# EAGLE design kapcsrajz (EAGLE 6.4)

## Sheet 1 of 5
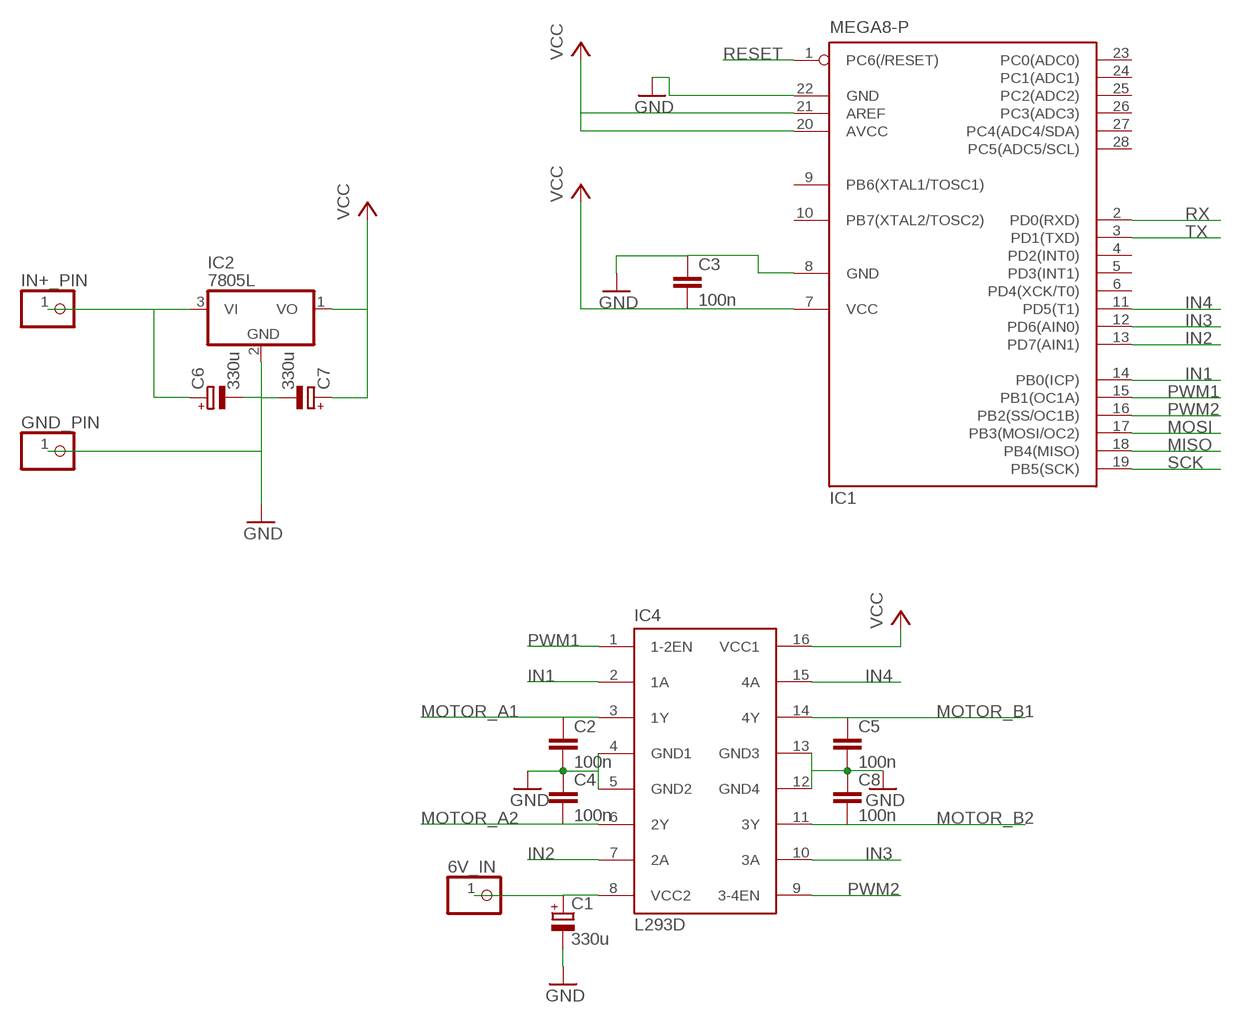
[diagram p0: schematic, sheet 1]

### Parts
6V_IN  PINHD-1X1  [1X01]
C1  330u  CPOL-EUE2,5-6E  [E2,5-6E]
C2  100n  C-EU025-030X050  [C025-030X050]
C3  100n  C-EU025-030X050  [C025-030X050]
C4  100n  C-EU025-030X050  [C025-030X050]
C5  100n  C-EU025-030X050  [C025-030X050]
C6  330u  CPOL-EUE2,5-6E  [E2,5-6E]
C7  330u  CPOL-EUE2,5-6E  [E2,5-6E]
C8  100n  C-EU025-030X050  [C025-030X050]
GND_PIN  PINHD-1X1  [1X01]
IC1  MEGA8-P  [DIL28-3]
IC2  7805L  [TO92]
IC4  L293D  [DIL16]
IN+_PIN  PINHD-1X1  [1X01]

### Nets
GND: C1.- C2.2 C3.1 C4.1 C5.2 C6.- C7.- C8.1 GND_PIN.1 IC1.8(GND) IC1.22(GND) IC2.2(GND) IC4.4(GND1) IC4.5(GND2) IC4.12(GND4) IC4.13(GND3) ; also sheet 2,3,4,5
IN1: IC1.14(PB0(ICP)) IC4.2(1A)
IN2: IC1.13(PD7(AIN1)) IC4.7(2A)
IN3: IC1.12(PD6(AIN0)) IC4.10(3A)
IN4: IC1.11(PD5(T1)) IC4.15(4A)
MISO: IC1.18(PB4(MISO)) ; also sheet 4
MOSI: IC1.17(PB3(MOSI/OC2)) ; also sheet 4,5
MOTOR_A1: C2.1 IC4.3(1Y) ; also sheet 5
MOTOR_A2: C4.2 IC4.6(2Y) ; also sheet 5
MOTOR_B1: C5.1 IC4.14(4Y) ; also sheet 5
MOTOR_B2: C8.2 IC4.11(3Y) ; also sheet 5
N$2: C6.+ IC2.3(VI) IN+_PIN.1
N$7: 6V_IN.1 C1.+ IC4.8(VCC2)
PWM1: IC1.15(PB1(OC1A)) IC4.1(1-2EN)
PWM2: IC1.16(PB2(SS/OC1B)) IC4.9(3-4EN)
RESET: IC1.1(PC6(/RESET)) ; also sheet 4
RX: IC1.2(PD0(RXD)) ; also sheet 3
SCK: IC1.19(PB5(SCK)) ; also sheet 4
TX: IC1.3(PD1(TXD)) ; also sheet 3
VCC: C3.2 C7.+ IC1.7(VCC) IC1.20(AVCC) IC1.21(AREF) IC2.1(VO) IC4.16(VCC1) ; also sheet 4,5
Unconnected: IC1.4(PD2(INT0)) IC1.5(PD3(INT1)) IC1.6(PD4(XCK/T0)) IC1.9(PB6(XTAL1/TOSC1)) IC1.10(PB7(XTAL2/TOSC2)) IC1.23(PC0(ADC0)) IC1.24(PC1(ADC1)) IC1.25(PC2(ADC2)) IC1.26(PC3(ADC3)) IC1.27(PC4(ADC4/SDA)) IC1.28(PC5(ADC5/SCL))

## Sheet 2 of 5
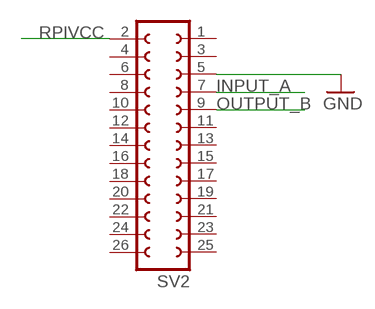
[diagram p1: schematic, sheet 2]

### Parts
SV2  FE13-2  [FE13-2]

### Nets
GND: SV2.5 ; also sheet 1,3,4,5
INPUT_A: SV2.7 ; also sheet 3
OUTPUT_B: SV2.9 ; also sheet 3
RPIVCC: SV2.2 ; also sheet 3
Unconnected: SV2.1 SV2.3 SV2.4 SV2.6 SV2.8 SV2.10 SV2.11 SV2.12 SV2.13 SV2.14 SV2.15 SV2.16 SV2.17 SV2.18 SV2.19 SV2.20 SV2.21 SV2.22 SV2.23 SV2.24 SV2.25 SV2.26

## Sheet 3 of 5
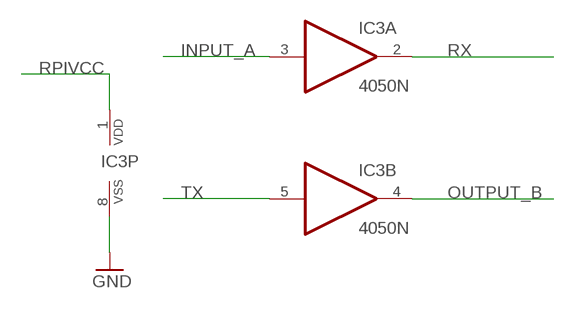
[diagram p2: schematic, sheet 3]

### Parts
IC3  4050N  [DIL16]

### Nets
GND: IC3.8(P:VSS) ; also sheet 1,2,4,5
INPUT_A: IC3.3(A:I) ; also sheet 2
OUTPUT_B: IC3.4(B:O) ; also sheet 2
RPIVCC: IC3.1(P:VDD) ; also sheet 2
RX: IC3.2(A:O) ; also sheet 1
TX: IC3.5(B:I) ; also sheet 1
Unconnected: IC3.6(C:O) IC3.7(C:I) IC3.9(D:I) IC3.10(D:O) IC3.11(E:I) IC3.12(E:O) IC3.14(F:I) IC3.15(F:O)

## Sheet 4 of 5
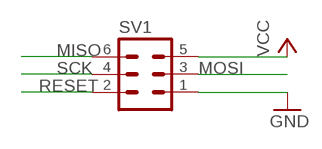
[diagram p3: schematic, sheet 4]

### Parts
SV1  MA03-2  [MA03-2]

### Nets
GND: SV1.1 ; also sheet 1,2,3,5
MISO: SV1.6 ; also sheet 1
MOSI: SV1.3 ; also sheet 1,5
RESET: SV1.2 ; also sheet 1
SCK: SV1.4 ; also sheet 1
VCC: SV1.5 ; also sheet 1,5

## Sheet 5 of 5
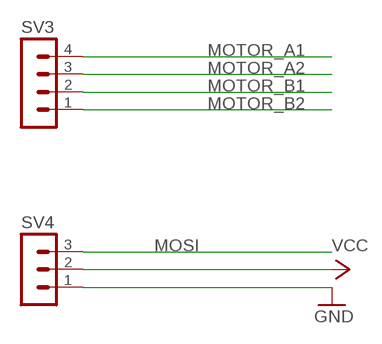
[diagram p4: schematic, sheet 5]

### Parts
SV3  MA04-1  [MA04-1]
SV4  MA03-1  [MA03-1]

### Nets
GND: SV4.1 ; also sheet 1,2,3,4
MOSI: SV4.3 ; also sheet 1,4
MOTOR_A1: SV3.4 ; also sheet 1
MOTOR_A2: SV3.3 ; also sheet 1
MOTOR_B1: SV3.2 ; also sheet 1
MOTOR_B2: SV3.1 ; also sheet 1
VCC: SV4.2 ; also sheet 1,4

## Library data of the parts
6V_IN GND_PIN IN+_PIN = pinhead:PINHD-1X1: PIN HEADER
C1 C6 C7 = rcl:CPOL-EU: POLARIZED CAPACITOR, European symbol
C2-C5 C8 = rcl:C-EU: CAPACITOR, European symbol
IC1 = atmel:MEGA8-P: MICROCONTROLLER 8 Kbytes FLASH, 1 kbytes SRAM, 512 bytes EEPROM, USART, 4-channel 10 bit ADC, 2-channel 8 bit ADC Pin compatible with Atmega48, ATMega88, ATMega168 Source: avr.lbr; OC_FARNELL: unknown; OC_NEWARK: unknown
IC2 = linear:78*: Positive VOLTAGE REGULATOR Source: http://cache.national.com/ds/LM/LM78L05.pdf http://www.fairchildsemi.com/ds/LM/LM7805.pdf
IC3 = 40xx:4050: Hex non-inverting BUFFER
IC4 = st-microelectronics:L293D: PUSH-PULL 4 CHANNEL DRIVER; MPN: L293D; OC_FARNELL: 9589619; OC_NEWARK: 56P8249
SV1 = con-lstb:MA03-2: PIN HEADER; OC_FARNELL: unknown; OC_NEWARK: unknown
SV2 = con-lsta:FE13-2: FEMALE HEADER; OC_FARNELL: unknown; OC_NEWARK: unknown
SV3 = con-lstb:MA04-1: PIN HEADER; OC_FARNELL: unknown; OC_NEWARK: unknown
SV4 = con-lstb:MA03-1: PIN HEADER; OC_FARNELL: unknown; OC_NEWARK: unknown

## Board
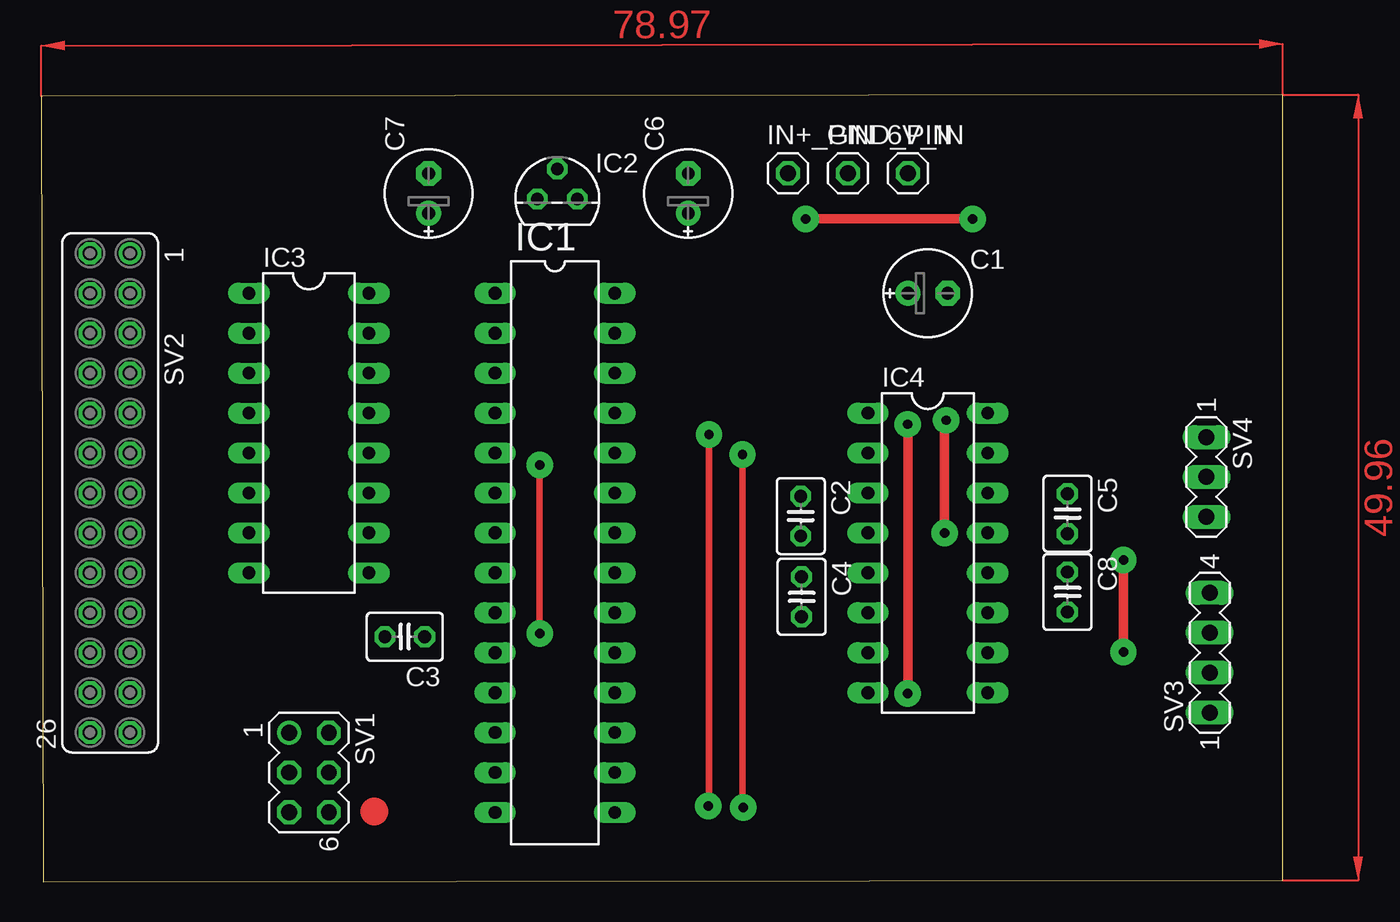
[diagram p5: board, top side]
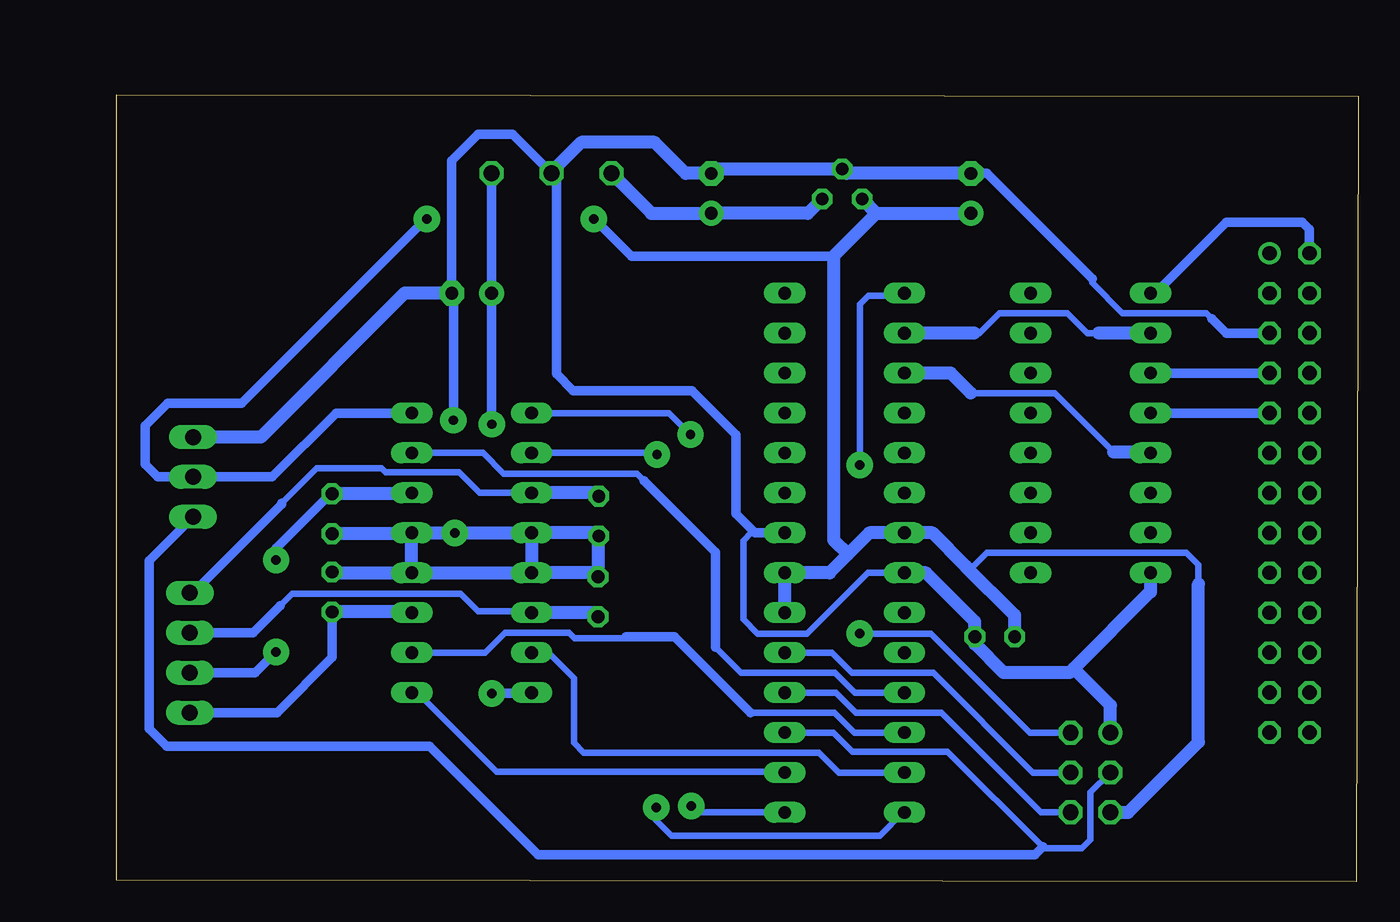
[diagram p6: board, bottom side, seen from below]

Size 78.97 x 50.06 mm. Coordinates in mm from the lower left corner, seen from the top.
Outline: 0.1,0 78.97,0.1 78.97,50.06 0,49.96 0.1,0
Copper layers (1*16): Top 0.035mm / dielectric 1.5mm / Bottom 0.035mm
Design rules "default *": minimum track width 10mil, minimum drill 24mil, track to track 10mil, track to pad 10mil, pad to pad 10mil, via to via 10mil, smd to smd 10mil, copper to edge 40mil, drill to drill 8mil, minimum pad ring 10mil, minimum via ring 8mil, stop-mask expansion 4mil, vias tented up to drill 0mil, thermal gap 10mil

### Footprints (pad centres in the part's own frame; a part is rotated, then mirrored left to right if it is on the bottom)
1X01 = drill 1.016 octagon: 1 0,0
E2,5-6E = drill 0.813 pad 1.575: + -1.27,0 | drill 0.813 pad 1.575 octagon: - 1.27,0
C025-030X050 = drill 0.813 octagon: 1 -1.27,0; 2 1.27,0
DIL28-3 = drill 0.813 long: 1 -16.51,-3.81; 2 -13.97,-3.81; 3 -11.43,-3.81; 4 -8.89,-3.81; 5 -6.35,-3.81; 6 -3.81,-3.81; 7 -1.27,-3.81; 8 1.27,-3.81; 9 3.81,-3.81; 10 6.35,-3.81; 11 8.89,-3.81; 12 11.43,-3.81; 13 13.97,-3.81; 14 16.51,-3.81; 15 16.51,3.81; 16 13.97,3.81; 17 11.43,3.81; 18 8.89,3.81; 19 6.35,3.81; 20 3.81,3.81; 21 1.27,3.81; 22 -1.27,3.81; 23 -3.81,3.81; 24 -6.35,3.81; 25 -8.89,3.81; 26 -11.43,3.81; 27 -13.97,3.81; 28 -16.51,3.81
TO92 = drill 0.813 octagon: 1 -1.27,0; 2 0,1.905; 3 1.27,0
DIL16 = drill 0.813 long: 1 -8.89,-3.81; 2 -6.35,-3.81; 3 -3.81,-3.81; 4 -1.27,-3.81; 5 1.27,-3.81; 6 3.81,-3.81; 7 6.35,-3.81; 8 8.89,-3.81; 9 8.89,3.81; 10 6.35,3.81; 11 3.81,3.81; 12 1.27,3.81; 13 -1.27,3.81; 14 -3.81,3.81; 15 -6.35,3.81; 16 -8.89,3.81
MA03-2 = drill 1.016: 1 -2.54,-1.27 | drill 1.016 octagon: 2 -2.54,1.27; 3 0,-1.27; 4 0,1.27; 5 2.54,-1.27; 6 2.54,1.27
FE13-2 = drill 0.914: 1 -15.24,1.27 | drill 0.914 octagon: 2 -15.24,-1.27; 3 -12.7,1.27; 4 -12.7,-1.27; 5 -10.16,1.27; 6 -10.16,-1.27; 7 -7.62,1.27; 8 -7.62,-1.27; 9 -5.08,1.27; 10 -5.08,-1.27; 11 -2.54,1.27; 12 -2.54,-1.27; 13 0,1.27; 14 0,-1.27; 15 2.54,1.27; 16 2.54,-1.27; 17 5.08,1.27; 18 5.08,-1.27; 19 7.62,1.27; 20 7.62,-1.27; 21 10.16,1.27; 22 10.16,-1.27; 23 12.7,1.27; 24 12.7,-1.27; 25 15.24,1.27; 26 15.24,-1.27
MA04-1 = drill 1.016 long: 1 -3.81,0; 2 -1.27,0; 3 1.27,0; 4 3.81,0
MA03-1 = drill 1.016 long: 1 -2.54,0; 2 0,0; 3 2.54,0

### Placement (x,y rotation side)
6V_IN  55.12,45.06 0 top
C1  56.39,37.44 0 top
C2  48.31,23.27 270 top
C3  23.11,15.6 180 top
C4  48.36,18.14 270 top
C5  65.28,23.42 270 top
C6  41.15,43.79 90 top
C7  24.64,43.79 90 top
C8  65.28,18.44 270 top
GND_PIN  51.31,45.06 0 top
IC1  32.66,20.93 270 top
IC2  32.82,43.43 0 top
IC3  17.02,28.55 270 top
IC4  56.39,20.93 270 top
IN+_PIN  47.5,45.06 0 top
SV1  17.02,6.96 270 top
SV2  4.37,24.74 270 top
SV3  74.32,14.58 90 top
SV4  74.12,25.76 270 top

### Tracks (layer width: path | path; a pad name or v marks a point on that pad's centre or on a via)
GND  (via drill 0.6 pad 1.68)
  Top 0.61: v57.56,29.36 57.45,29.26 v57.45,22.2
  Bottom 0.406: 9.3,35.81 9.65,36.17 14.99,36.17 16.92,38.1 16.92,38.35 | IC1.8 31.19,19.66 35.05,15.8 38.2,15.8 39.12,16.71 39.12,21.69 38.61,22.2 IC1.22
  Bottom 0.61: v57.56,29.36 57.56,37.34 C1.- 57.66,45.87 55.98,47.55 53.8,47.55 GND_PIN.1 51,44.75 51,32.31 49.94,31.24 42.37,31.24 39.57,28.45 39.57,23.42 38.35,22.2 IC1.22 | SV2.5 8.38,34.9 9.3,35.81 | 16.92,38.35 23.62,45.06 C7.-
  Bottom 0.813: C7.- 32.54,45.06 IC2.2 40.87,45.34 C6.- 42.77,45.06 44.76,47.04 49.43,47.04 51.31,45.16 GND_PIN.1 | IC3.8 13.21,18.44 18.09,13.56 | 18.09,13.56 18.34,13.31 22.55,13.31 24.38,15.14 C3.1 24.38,16.56 27.48,19.66 IC1.8 | IC4.4 IC4.5 | C4.1 48.62,19.66 IC4.5 | IC4.4 48.51,22.2 C2.2 48.36,21.95 48.36,19.46 | IC4.13 v57.45,22.2 IC4.4 | IC4.5 IC4.12 65.23,19.66 C8.1 | IC4.13 60.25,22.15 60.25,19.61 | IC4.13 60.35,22.05 60.45,22.05 60.55,22.15 C5.2 | SV1.1 15.75,11.23 18.09,13.56 | C1.- 60.66,37.44 69.8,28.3 SV4.1
IN1  (via drill 0.6 pad 1.68)
  Top 0.406: v44.6,27.18 44.6,4.78 v44.65,4.72
  Bottom 0.406: 28.45,4.37 28.8,4.37 IC1.14 28.96,4.42 30.43,2.95 43.69,2.95 44.65,3.91 v44.65,4.72 | IC4.2 44.7,27.28 v44.6,27.18
IN2
  Bottom 0.406: IC1.13 33.02,6.96 34.29,8.23 49.28,8.23 49.89,8.84 49.89,12.95 51.71,14.78 51.92,14.58 IC4.7
IN3
  Bottom 0.406: IC1.12 32.05,9.5 33.33,10.77 38.66,10.77 | 46.58,15.6 46.69,15.49 49.84,15.49 50.19,15.85 54.25,15.85 55.52,14.58 IC4.10
  Bottom 0.61: 38.66,10.77 43.48,15.6 46.58,15.6
IN4
  Bottom 0.406: IC1.11 32,12.04 33.27,13.31 39.27,13.31 40.89,14.94 | 45.41,25.5 45.87,25.96 54.36,25.96 55.68,27.28 IC4.15
  Bottom 0.61: 40.89,14.94 40.89,20.98 45.41,25.5
INPUT_A
  Bottom 0.61: SV2.7 IC3.3
MISO
  Bottom 0.406: SV1.6 20.17,4.42 26.52,10.77 31.95,10.77 33.22,12.04 IC1.18
MOSI
  Bottom 0.406: SV1.3 17.02,5.69 17.02,2.69 17.58,2.13 19.96,2.13 20.07,2.24 26.11,8.28 32.16,8.28 33.38,9.5 IC1.17
  Bottom 0.61: SV4.3 76.91,20.42 76.91,9.75 75.79,8.64 59.08,8.64 52.17,1.73 20.57,1.73 20.07,2.24
MOTOR_A1
  Bottom 0.406: IC4.3 55.88,24.74 57.2,26.06 61.87,26.06 62.13,26.31 66.24,26.31 68.48,24.08
  Bottom 0.61: 68.48,24.08 68.48,24.03 74.12,18.39 SV3.4
  Bottom 0.813: C2.1 48.51,24.74 IC4.3
MOTOR_A2
  Bottom 0.406: IC4.6 52.48,17.22 | 52.48,17.22 52.43,17.22 | 52.48,17.22 55.98,17.22 57.1,18.34 67.82,18.34 68.58,17.58
  Bottom 0.61: 68.58,17.58 70.31,15.85 SV3.3
  Bottom 0.813: C4.2 48.62,17.12 IC4.6
MOTOR_B1  (via drill 0.6 pad 1.68)
  Top 0.61: v68.83,20.47 68.83,15.14 v68.83,14.63
  Bottom 0.61: C5.1 65.33,24.64 65.43,24.64 68.83,21.23 v68.83,20.47 | SV3.2 70.15,13.31 v68.83,14.63
  Bottom 0.813: IC4.14 60.25,24.69 C5.1
MOTOR_B2
  Bottom 0.61: C8.2 65.28,14.27 68.78,10.77 SV3.1
  Bottom 0.813: IC4.11 60.25,17.17 C8.2
N$2
  Bottom 0.813: IN+_PIN.1 44.96,42.52 C6.+ 35,42.52 IC2.3
N$7  (via drill 0.6 pad 1.68)
  Top 0.61: v55.12,11.99 v55.12,29.11
  Bottom 0.61: IC4.8 52.63,11.99 v55.12,11.99 | v55.12,29.11 C1.+ 6V_IN.1
OUTPUT_B
  Bottom 0.61: SV2.9 IC3.4
PWM1  (via drill 0.6 pad 1.68)
  Top 0.406: v42.47,28.45 42.47,4.88 v42.42,4.83
  Bottom 0.406: IC4.1 43.84,29.82 v42.47,28.45 | v42.42,4.83 42.01,4.42 IC1.15
PWM2
  Bottom 0.406: IC1.16 36.52,7.01 54.81,7.01 59.84,12.04 IC4.9
RESET  (via drill 0.6 pad 1.68)
  Top 0.406: v31.7,15.8 v31.7,26.52
  Bottom 0.406: SV1.2 20.88,9.5 27.18,15.8 v31.7,15.8 | v31.7,26.52 31.7,36.73 31.14,37.29 29.01,37.29 IC1.1
RPIVCC
  Bottom 0.61: SV2.2 3.1,41.5 3.56,41.96 8.38,41.96 12.9,37.44 IC3.1
RX
  Bottom 0.406: 16.51,34.9 17.22,34.9 18.49,36.17 22.81,36.17 24.08,34.9 24.43,34.9
  Bottom 0.813: IC3.2 16.51,34.9 | 24.43,34.9 IC1.2
SCK
  Bottom 0.406: SV1.4 20.68,6.96 27.03,13.31 32.21,13.31 33.48,14.58 IC1.19
TX
  Bottom 0.406: 15.55,27.33 19.3,31.09 24.64,31.09
  Bottom 0.813: IC3.5 13.26,27.33 15.55,27.33 | 24.64,31.09 25.91,32.36 IC1.3
VCC  (via drill 0.6 pad 1.68)
  Top 0.61: v59.23,42.16 v48.62,42.16
  Bottom 0.406: 10.16,18.95 10.16,20.17 10.92,20.93 23.62,20.93 24.46,20.09 24.97,20.09
  Bottom 0.61: v59.23,42.16 59.28,42.16 71.02,30.43 75.74,30.43 77.16,29.01 77.16,26.57 76.35,25.76 74.62,25.76 SV4.2 69.09,25.76 65.02,29.82 IC4.16 | v48.62,42.16 46.23,39.78 33.38,39.78
  Bottom 0.813: IC2.1 30.63,42.52 | 30.63,42.52 C7.+ | C3.2 21.84,16.97 24.97,20.09 27.08,22.2 IC1.7 31.09,22.2 32.46,20.83 | 32.46,20.83 33.63,19.66 IC1.21 IC1.20 | SV1.5 14.63,4.42 10.16,8.89 10.16,18.95 | 30.63,42.52 33.38,39.78 33.38,21.74 32.46,20.83
(copper drawn outside any net)
  shapes: Top area x2, Top circle x1